# EasyEDA Pro project ProPrj_Hitboard PCB 分体_2025-12-19.epro

# Board PCB1
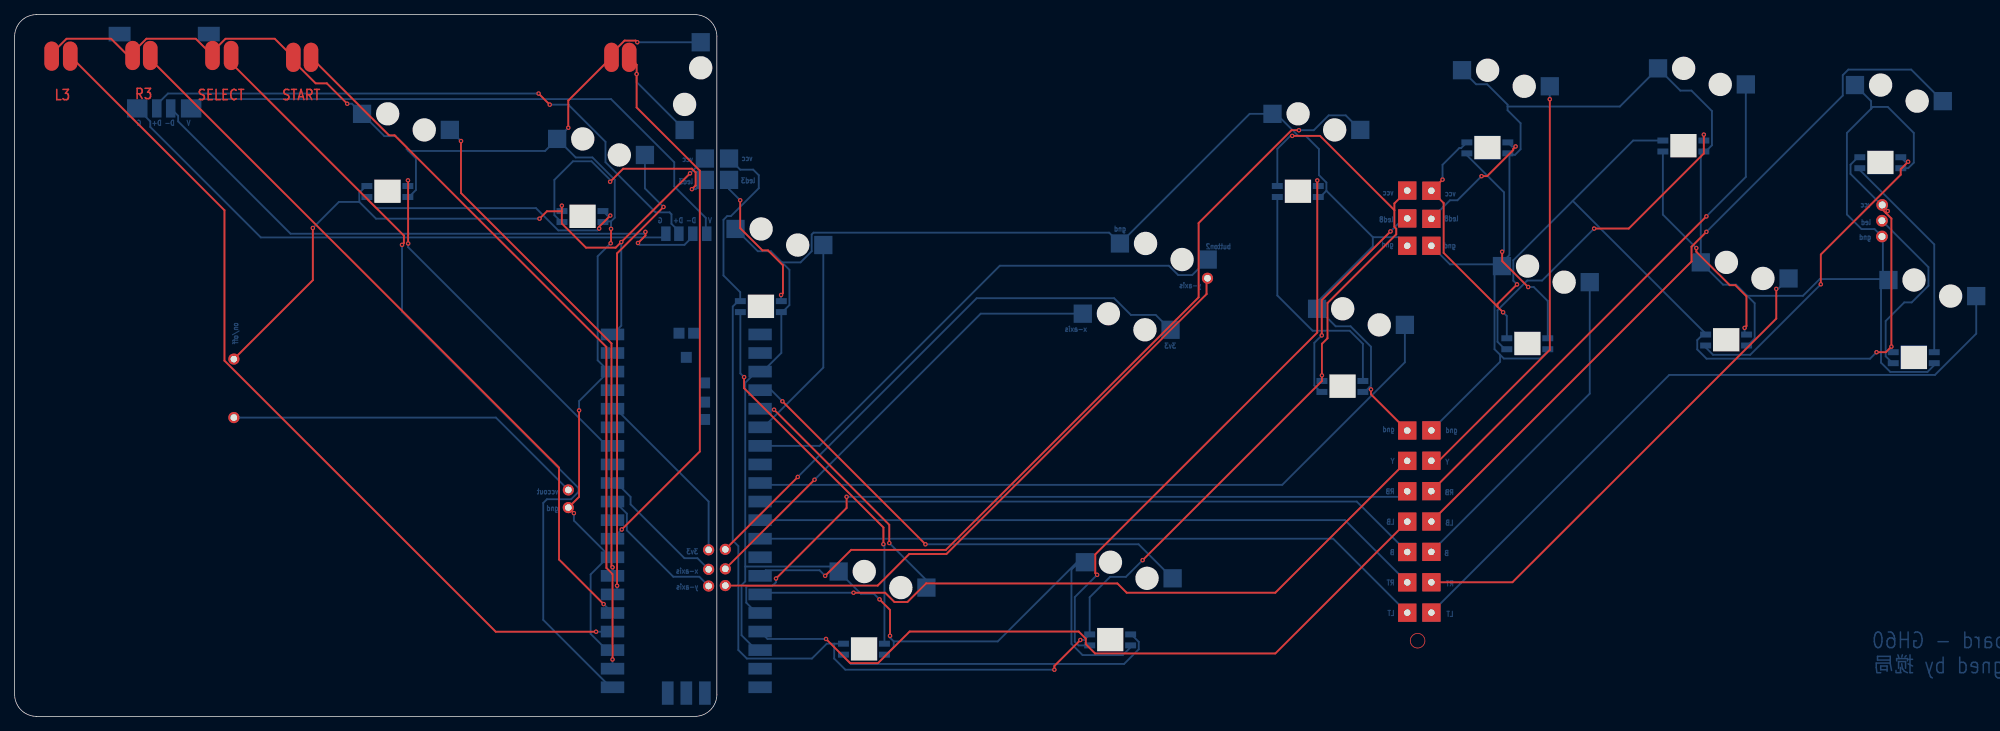
[diagram p0: board, top side]
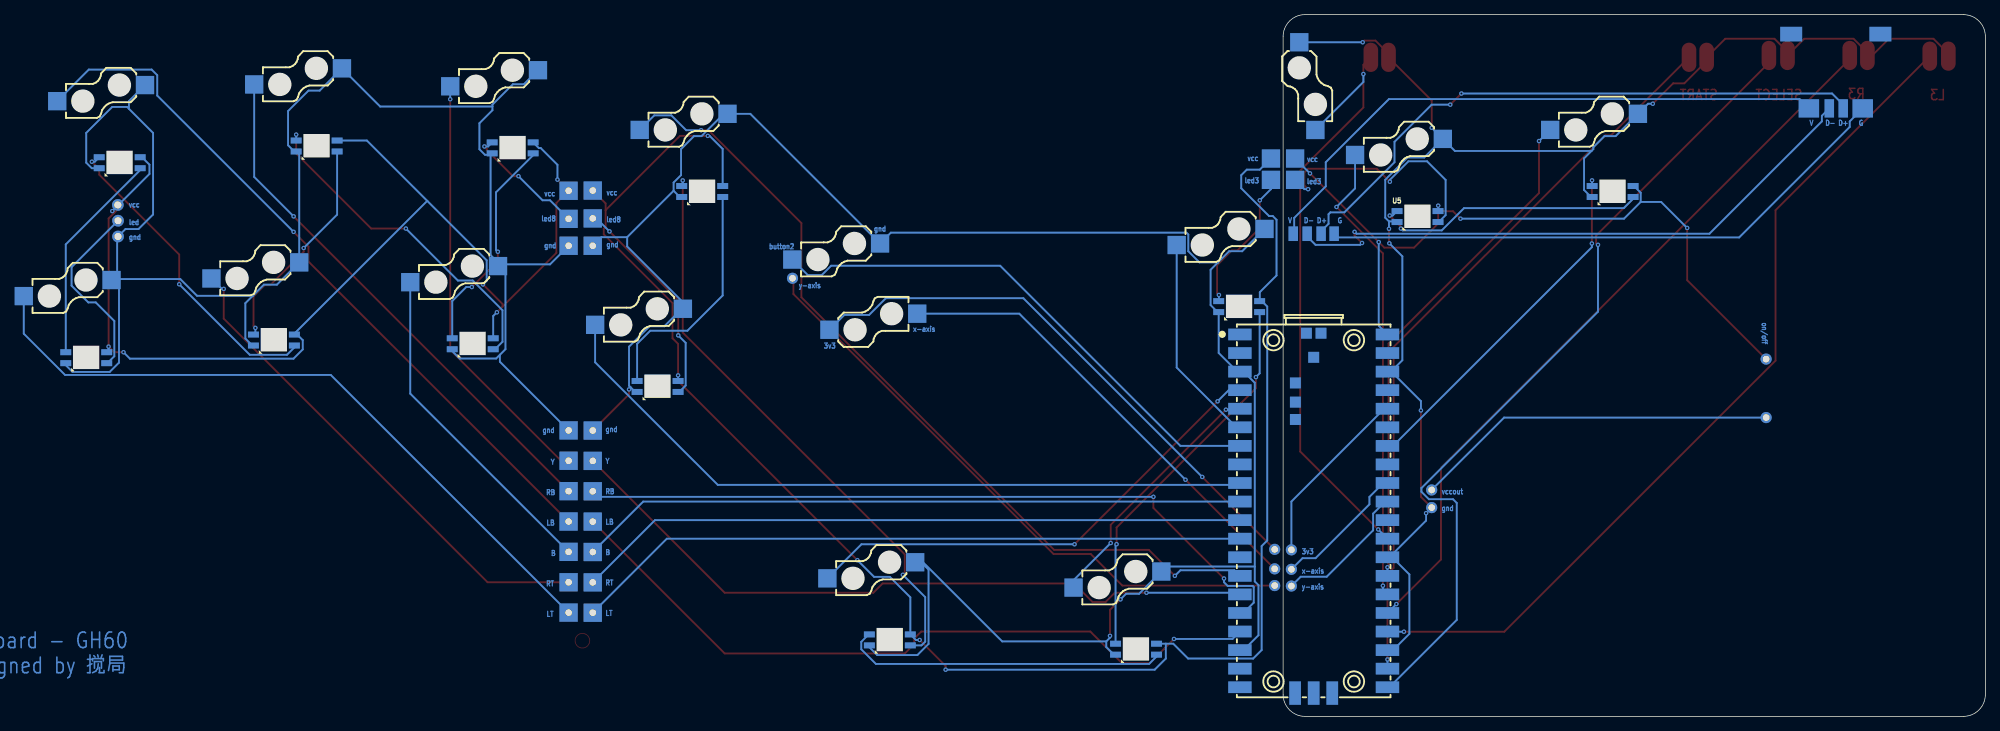
[diagram p1: board, bottom side, seen from below]

Outline 266.25 x 96 mm; copper layers: Top Layer, Bottom Layer. Coordinates in mm from the lower left corner of the outline.
Outline path: 0,93 0,3 arc(0.88,0.88) 3,0 93,0 arc(95.12,0.88) 96,3 96,93 arc(95.12,95.12) 93,96 3,96 arc(0.88,95.12) 0,93
Stack: Top Layer 0.035mm / Dielectric1 1.51mm FR4 er 4.5 / Bottom Layer 0.035mm

## Design rules (mm)
template: JLCPCB Capability(Two Layers Board)
spacing copperThickness1oz (default): track to track 0.102, other pairs 0.152 to 0.3
spacing copperThickness2oz: track to track 0.203, other pairs 0.152 to 0.3
track width copperThickness1oz (default): min 0.127, default 0.254, max 2.54
track width copperThickness2oz: min 0.203, default 0.254, max 2.54
differential pair differentialPair (default): width min 0.127, default 0.254, max 2.54; gap min 0.152, default 0.152
via viaSize (default): diameter min 0.5, default 0.61, max 10; hole min 0.3, default 0.305, max 6.3

## Placement (name value [footprint] x y rotation side)
NOREF  -  [Pad_e62]  75.69 28.56 0 top
NOREF#2  -  [Pad_e693]  92.71 66.03 180 top
NOREF#3  -  [Pad_e684]  19.43 83.17 180 top
NOREF#4  -  [Pad_e6736]  94.36 76.31 0 top
NOREF#5  -  [Pad_e13605]  190.37 26.64 0 top
NOREF#6  -  [Pad_e13636]  193.68 64.38 0 top
NOREF#7  -  [Pad_e48]  94.87 20.12 0 top
NOREF#8  -  [Pad_e13635]  193.68 68.06 0 top
NOREF#9  -  [Pad_e6737]  97.66 73.39 0 top
NOREF#10  -  [Pad_e675]  5.06 90.32 0 top
NOREF#11  -  [Pad_e13602]  190.37 64.38 0 top
NOREF#12  -  [Pad_e69]  193.68 34.97 0 top
NOREF#13  -  [Pad_e689]  89.03 66.03 180 top
NOREF#14  -  [Pad_e679]  27.05 90.41 0 top
NOREF#15  -  [Pad_e687]  97.66 76.31 0 top
NOREF#16  -  [Pad_e683]  16.76 83.17 180 top
NOREF#17  -  [Pad_e61146]  255.3 69.97 0 top
NOREF#18  -  [Pad_e61]  75.69 30.98 0 top
NOREF#19  -  [Pad_e676]  7.6 90.32 0 top
NOREF#20  -  [Pad_e13603]  190.37 34.95 0 top
NOREF#21  -  [Pad_e72]  193.68 22.5 0 top
NOREF#22  -  [Pad_e680]  29.59 90.41 0 top
NOREF#23  -  [Pad_e13606]  190.37 22.49 0 top
NOREF#24  -  [Pad_e13607]  190.37 18.33 0 top
NOREF#25  -  [Pad_e61147]  255.27 67.81 0 top
NOREF#26  -  [Pad_e59]  29.97 48.88 0 top
NOREF#27  -  [Pad_e41]  97.16 22.85 0 top
NOREF#28  -  [Pad_e5941]  163.07 59.93 0 top
NOREF#29  -  [Pad_e114539]  190.37 39.1 0 top
NOREF#30  -  [Pad_e61148]  255.27 65.65 0 top
NOREF#31  -  [Pad_e73]  193.68 18.35 0 top
NOREF#32  -  [Pad_e13601]  190.37 68.12 0 top
NOREF#33  -  [Pad_e13604]  190.37 30.8 0 top
NOREF#34  -  [Pad_e13608]  190.37 14.18 0 top
NOREF#35  -  [Pad_e46]  94.87 22.78 0 top
NOREF#36  -  [Pad_e56]  81.6 90.16 0 top
NOREF#37  -  [Pad_e43]  97.16 20.18 0 top
NOREF#38  -  [Pad_e13600]  190.37 71.93 0 top
NOREF#39  -  [Pad_e686]  24.13 83.17 180 top
NOREF#40  -  [Pad_e677]  16.13 90.41 0 top
NOREF#41  -  [Pad_e53995]  14.35 93.33 180 top
NOREF#42  -  [Pad_e6738]  94.36 73.39 0 top
NOREF#43  -  [Pad_e13637]  193.68 71.9 0 top
NOREF#44  -  [Pad_e53994]  26.54 93.33 180 top
NOREF#45  -  [Pad_e70]  193.68 30.81 0 top
NOREF#46  -  [Pad_e68]  193.68 39.12 0 top
NOREF#47  -  [Pad_e682]  40.51 90.16 0 top
NOREF#48  -  [Pad_e691]  90.81 66.03 180 top
NOREF#49  -  [Pad_e685]  21.34 83.17 180 top
NOREF#50  -  [Pad_e60]  29.97 40.88 0 top
NOREF#51  -  [Pad_e44]  97.16 17.9 0 top
NOREF#52  -  [Pad_e681]  38.1 90.16 0 top
NOREF#53  -  [Pad_e57]  84.01 90.16 0 top
NOREF#54  -  [Pad_e51]  94.87 17.83 0 top
NOREF#55  -  [Pad_e71]  193.68 26.66 0 top
NOREF#56  -  [Pad_e74]  193.68 14.2 0 top
NOREF#57  -  [Pad_e678]  18.54 90.41 0 top
NOREF#58  -  [Pad_e694]  94.61 66.03 180 top
U1  PICO  [COMM-SMD_L51.0-W21.0-P2.54_SC0916]  91.82 27.8 270 bottom
U5  -  [LED-SMD_L3.2-W2.8_YO-WS2812B-3528]  50.95 71.8 180 bottom
U5#2  -  [LED-SMD_L3.2-W2.8_YO-WS2812B-3528]  77.62 68.37 180 bottom
U5#3  -  [LED-SMD_L3.2-W2.8_YO-WS2812B-3528]  102.01 56.05 180 bottom
U5#4  -  [LED-SMD_L3.2-W2.8_YO-WS2812B-3528]  116.11 9.19 180 bottom
U5#5  -  [LED-SMD_L3.2-W2.8_YO-WS2812B-3528]  149.76 10.46 180 bottom
U5#6  -  [LED-SMD_L3.2-W2.8_YO-WS2812B-3528]  175.41 71.8 180 bottom
U5#7  -  [LED-SMD_L3.2-W2.8_YO-WS2812B-3528]  181.51 45.13 180 bottom
U5#8  -  [LED-SMD_L3.2-W2.8_YO-WS2812B-3528]  201.32 77.77 180 bottom
U5#9  -  [LED-SMD_L3.2-W2.8_YO-WS2812B-3528]  206.78 50.97 180 bottom
U5#10  -  [LED-SMD_L3.2-W2.8_YO-WS2812B-3528]  228.12 78.03 180 bottom
U5#11  -  [LED-SMD_L3.2-W2.8_YO-WS2812B-3528]  233.96 51.48 180 bottom
U5#12  -  [LED-SMD_L3.2-W2.8_YO-WS2812B-3528]  255.04 75.74 180 bottom
U5#13  -  [LED-SMD_L3.2-W2.8_YO-WS2812B-3528]  259.62 49.07 180 bottom
U6  -  [CONN-SMD_HOTPLUGPAKAGE__C9900010116-1]  152.02 53.99 0 bottom
U6#2  -  [CONN-SMD_HOTPLUGPAKAGE__C9900010116-1]  157.1 63.59 180 bottom
U6#3  -  [CONN-SMD_HOTPLUGPAKAGE__C9900010116-1]  92.69 86.22 90 bottom
U6#4  -  [CONN-SMD_HOTPLUGPAKAGE__C9900010116-1]  53.49 81.33 180 bottom
U6#5  -  [CONN-SMD_HOTPLUGPAKAGE__C9900010116-1]  80.16 77.9 180 bottom
U6#6  -  [CONN-SMD_HOTPLUGPAKAGE__C9900010116-1]  104.55 65.58 180 bottom
U6#7  -  [CONN-SMD_HOTPLUGPAKAGE__C9900010116-1]  118.65 18.72 180 bottom
U6#8  -  [CONN-SMD_HOTPLUGPAKAGE__C9900010116-1]  152.3 19.99 180 bottom
U6#9  -  [CONN-SMD_HOTPLUGPAKAGE__C9900010116-1]  177.95 81.33 180 bottom
U6#10  -  [CONN-SMD_HOTPLUGPAKAGE__C9900010116-1]  184.05 54.66 180 bottom
U6#11  -  [CONN-SMD_HOTPLUGPAKAGE__C9900010116-1]  203.86 87.3 180 bottom
U6#12  -  [CONN-SMD_HOTPLUGPAKAGE__C9900010116-1]  209.32 60.5 180 bottom
U6#13  -  [CONN-SMD_HOTPLUGPAKAGE__C9900010116-1]  230.66 87.55 180 bottom
U6#14  -  [CONN-SMD_HOTPLUGPAKAGE__C9900010116-1]  236.5 61.01 180 bottom
U6#15  -  [CONN-SMD_HOTPLUGPAKAGE__C9900010116-1]  257.58 85.27 180 bottom
U6#16  -  [CONN-SMD_HOTPLUGPAKAGE__C9900010116-1]  262.16 58.59 180 bottom

## Footprints (pads in the part's own frame, mm; a bottom-side part is the same pattern mirrored in y, then rotated)
COMM-SMD_L51.0-W21.0-P2.54_SC0916
  rect 1.6x3.2 smd: 1(-24.445,-10.088) 2(-21.905,-10.088) 3(-19.365,-10.088) 4(-16.825,-10.088) 5(-14.285,-10.088) 6(-11.745,-10.088) 7(-9.205,-10.088) 8(-6.665,-10.088) 9(-4.125,-10.088) 10(-1.585,-10.088) 11(0.955,-10.088) 12(3.495,-10.088) 13(6.035,-10.088) 14(8.575,-10.088) 15(11.115,-10.088) 16(13.655,-10.088) 17(16.195,-10.088) 18(18.735,-10.088) 19(21.275,-10.088) 20(23.815,-10.088) 21(23.815,10.088) 22(21.275,10.088) 23(18.735,10.088) 24(16.195,10.088) 25(13.655,10.088) 26(11.115,10.088) 27(8.575,10.088) 28(6.035,10.088) 29(3.495,10.088) 30(0.955,10.088) 31(-1.585,10.088) 32(-4.125,10.088) 33(-6.665,10.088) 34(-9.205,10.088) 35(-11.745,10.088) 36(-14.285,10.088) 37(-16.825,10.088) 38(-19.365,10.088) 39(-21.905,10.088) 40(-24.445,10.088)
  rect 3.2x1.6 smd: 41(24.615,-2.54) 42(24.615,0) 43(24.615,2.54)
  rect 1.5x1.5 smd: TP1(-21.315,0) TP2(-24.615,1) TP3(-24.615,-1) TP4(-17.815,-2.5) TP5(-15.188,-2.5) TP6(-12.815,-2.5)
CONN-SMD_HOTPLUGPAKAGE__C9900010116-1
  rect 2.5x2.5 smd: 1(-6,-1.1) 2(6,1.1)
LED-SMD_L3.2-W2.8_YO-WS2812B-3528
  rect 1.5x0.82 smd: 1(2.8,0.75) 2(2.8,-0.75) 3(-2.8,-0.75) 4(-2.8,0.75)
Pad_e41
  round 1.524 hole 0.914: 1(0,0)
Pad_e43
  round 1.524 hole 0.914: 1(0,0)
Pad_e44
  round 1.524 hole 0.914: 1(0,0)
Pad_e46
  round 1.524 hole 0.914: 1(0,0)
Pad_e48
  round 1.524 hole 0.914: 1(0,0)
Pad_e51
  round 1.524 hole 0.914: 1(0,0)
Pad_e56
  oval 2x4 smd: 1(0,0)
Pad_e57
  oval 2x4 smd: 1(0,0)
Pad_e59
  round 1.524 hole 0.914: 1(0,0)
Pad_e60
  round 1.524 hole 0.914: 1(0,0)
Pad_e61
  round 1.524 hole 0.914: 1(0,0)
Pad_e62
  round 1.524 hole 0.914: 1(0,0)
Pad_e68
  rect 2.5x2.5 hole 0.9: PTH(0,0)
Pad_e69
  rect 2.5x2.5 hole 0.9: PTH(0,0)
Pad_e70
  rect 2.5x2.5 hole 0.9: PTH(0,0)
Pad_e71
  rect 2.5x2.5 hole 0.9: PTH(0,0)
Pad_e72
  rect 2.5x2.5 hole 0.9: PTH(0,0)
Pad_e73
  rect 2.5x2.5 hole 0.9: PTH(0,0)
Pad_e74
  rect 2.5x2.5 hole 0.9: PTH(0,0)
Pad_e675
  oval 2x4 smd: 1(0,0)
Pad_e676
  oval 2x4 smd: 1(0,0)
Pad_e677
  oval 2x4 smd: 1(0,0)
Pad_e678
  oval 2x4 smd: 1(0,0)
Pad_e679
  oval 2x4 smd: 1(0,0)
Pad_e680
  oval 2x4 smd: 1(0,0)
Pad_e681
  oval 2x4 smd: 1(0,0)
Pad_e682
  oval 2x4 smd: 1(0,0)
Pad_e683
  rect 2.8x2.5 smd far side: PTH(0,0)
Pad_e684
  rect 1.3x2.5 smd far side: PTH(0,0)
Pad_e685
  rect 1.3x2.5 smd far side: PTH(0,0)
Pad_e686
  rect 2.8x2.5 smd far side: PTH(0,0)
Pad_e687
  rect 2.5x2.5 smd far side: PTH(0,0)
Pad_e689
  rect 1.3x2 smd far side: PTH(0,0)
Pad_e691
  rect 1.3x2 smd far side: PTH(0,0)
Pad_e693
  rect 1.3x2 smd far side: PTH(0,0)
Pad_e694
  rect 1.3x2 smd far side: PTH(0,0)
Pad_e5941
  round 1.524 hole 0.914: 1(0,0)
Pad_e6736
  rect 2.5x2.5 smd far side: PTH(0,0)
Pad_e6737
  rect 2.5x2.5 smd far side: PTH(0,0)
Pad_e6738
  rect 2.5x2.5 smd far side: PTH(0,0)
Pad_e13600
  rect 2.5x2.5 hole 0.9: PTH(0,0)
Pad_e13601
  rect 2.5x2.5 hole 0.9: PTH(0,0)
Pad_e13602
  rect 2.5x2.5 hole 0.9: PTH(0,0)
Pad_e13603
  rect 2.5x2.5 hole 0.9: PTH(0,0)
Pad_e13604
  rect 2.5x2.5 hole 0.9: PTH(0,0)
Pad_e13605
  rect 2.5x2.5 hole 0.9: PTH(0,0)
Pad_e13606
  rect 2.5x2.5 hole 0.9: PTH(0,0)
Pad_e13607
  rect 2.5x2.5 hole 0.9: PTH(0,0)
Pad_e13608
  rect 2.5x2.5 hole 0.9: PTH(0,0)
Pad_e13635
  rect 2.5x2.5 hole 0.9: PTH(0,0)
Pad_e13636
  rect 2.5x2.5 hole 0.9: PTH(0,0)
Pad_e13637
  rect 2.5x2.5 hole 0.9: PTH(0,0)
Pad_e53994
  rect 3x2 smd far side: PTH(0,0)
Pad_e53995
  rect 3x2 smd far side: PTH(0,0)
Pad_e61146
  round 1.6 hole 0.96: PTH(0,0)
Pad_e61147
  round 1.6 hole 0.96: PTH(0,0)
Pad_e61148
  round 1.6 hole 0.96: PTH(0,0)
Pad_e114539
  rect 2.5x2.5 hole 0.9: PTH(0,0)

## Nets
3V3: NOREF#27.1 NOREF#35.1 U1.36 U6.2
GND: NOREF.1 NOREF#6.PTH NOREF#10.1 NOREF#11.PTH NOREF#14.1 NOREF#29.PTH NOREF#30.PTH NOREF#36.1 NOREF#40.1 NOREF#46.PTH NOREF#52.1 U1.3 U1.18 U1.23 U1.28 U1.38 U5.3 U5#2.3 U5#3.3 U5#4.3 U5#5.3 U5#6.3 U5#7.3 U5#8.3 U5#9.3 U5#10.3 U5#11.3 U5#12.3 U5#13.3 U6#2.2 U6#3.2 U6#4.2 U6#5.2 U6#6.2 U6#7.2 U6#8.2 U6#9.2 U6#10.2 U6#11.2 U6#12.2 U6#13.2 U6#14.2 U6#15.2 U6#16.2
VCC: NOREF#4.PTH NOREF#15.PTH NOREF#17.PTH NOREF#26.1 NOREF#38.PTH NOREF#43.PTH U1.40 U5.1 U5#2.1 U5#3.1 U5#4.1 U5#5.1 U5#6.1 U5#7.1 U5#8.1 U5#9.1 U5#10.1 U5#11.1 U5#12.1 U5#13.1
VCCOUT: NOREF#18.1 NOREF#50.1
2: U5.2 U5#2.4
3: NOREF#9.PTH NOREF#42.PTH U5#2.2 U5#3.4
4: U5#3.2 U5#4.4
5: U5#4.2 U5#5.4
6: U5#5.2 U5#6.4
7: U5#6.2 U5#7.4
8: NOREF#8.PTH NOREF#32.PTH U5#7.2 U5#8.4
9: U5#8.2 U5#9.4
10: U5#9.2 U5#10.4
11: U5#10.2 U5#11.4
12: U5#11.2 U5#12.4
13: U5#12.2 U5#13.4
14: NOREF#25.PTH U5#13.2
A: U1.9 U6#10.1
B: NOREF#21.PTH NOREF#23.PTH U1.10 U6#12.1
BUTTON1: U1.5 U6#7.1
BUTTON2: U1.7 U6#2.1
CAPTURE: NOREF#53.1 U1.29 U6#3.1
D+: NOREF#3.PTH NOREF#48.PTH
D-: NOREF#2.PTH NOREF#49.PTH
DOWN: U1.26 U6#5.1
G: NOREF#13.PTH NOREF#16.PTH
L3: NOREF#19.1 U1.24
LB: NOREF#5.PTH NOREF#55.PTH U1.17 U6#15.1
LED1: U1.34 U5.4
LEFT: U1.27 U6#4.1
LT: NOREF#34.PTH NOREF#56.PTH U1.12 U6#16.1
R3: NOREF#57.1 U1.25
RB: NOREF#33.PTH NOREF#45.PTH U1.16 U6#13.1
RIGHT: U1.6 U6#6.1
RT: NOREF#24.PTH NOREF#31.PTH U1.11 U6#14.1
SELECT: NOREF#22.1 U1.21
START: NOREF#47.1 U1.22
UP: U1.4 U6#8.1
V: NOREF#39.PTH NOREF#58.PTH
X: U1.14 U6#9.1
X-AXIS: NOREF#7.1 NOREF#37.1 U1.32 U6.1
Y: NOREF#12.PTH NOREF#20.PTH U1.15 U6#11.1
Y-AXIS: NOREF#28.1 NOREF#51.1 NOREF#54.1 U1.31

Pads without a net: NOREF#41 PTH; NOREF#44 PTH; U1 1 2 8 13 19 20 30 33 35 37 39 41 42 43 TP1 TP2 TP3 TP4 TP5 TP6

## Via types
v1: diameter 0.61, hole 0.305, Top Layer to Bottom Layer, 80 vias

## Routing (per net, layer and track width the routed paths; a pad name or vN(x,y) marks a point on that pad's centre or on a via; arc(x,y) is an arc through that point)
3V3: length 101.9
  Top Layer w0.254: NOREF#27.1 v1(107.06,32.75)
  Bottom Layer w0.254: v1(107.06,32.75) 131.51,57.2 150.31,57.2 152.59,54.92 155.99,54.92 158.02,52.89 ; NOREF#35.1 94.87,29.39 82.17,42.09 U1.36
GND: length 729.5
  Top Layer w0.254: 15.98,90.41 NOREF#40.1 ; 15.98,90.41 15.48,90.41 13.19,92.7 7.09,92.7 5.06,90.67 NOREF#10.1 ; 15.98,90.41 15.98,90.67 18.02,92.7 24.77,92.7 NOREF#14.1 27.05,90.92 28.83,92.7 35.56,92.7 NOREF#52.1 38.1,89.65 41.15,86.6 42.67,86.6 v1(45.47,83.81) ; v1(118.23,16.01) 119.67,14.57 v1(119.67,11.02) ; NOREF#29.PTH 185.42,44.06 v1(185.42,44.73) ; v1(76.45,27.8) NOREF.1 77.16,30.03 v1(77.16,41.86) ; v1(75.69,80.52) 75.69,84.25 NOREF#36.1 81.6,90.67 83.38,92.44 84.9,92.44 v1(85.12,92.22) ; v1(81.53,66.7) 81.53,64.77 v1(81.48,64.72)
  Bottom Layer w0.254: 204.09,83.43 219.44,83.43 U6#13.2 227.71,85.6 229.23,85.6 232.03,82.81 232.03,78.13 231.17,77.28 U5#10.3 230.5,76.86 U6#14.2 233.55,59.06 235.33,59.06 236.85,57.54 ; 204.09,83.43 204.09,82.92 205.87,81.14 205.87,77.58 205.1,76.82 204.34,76.82 ; 204.09,83.43 204.09,83.68 201.29,86.47 199.78,86.47 U6#11.2 ; U6#16.2 256.03,59.82 255.9,59.82 ; U5#5.3 152.56,9.46 151.49,8.39 145.99,8.39 144.47,9.91 144.47,20.07 145.49,21.09 ; 204.34,76.82 204.34,63.11 203.07,61.84 ; 204.34,76.82 U5#8.3 ; 81.23,47.19 77.16,43.13 v1(77.16,41.86) ; 81.23,47.19 81.71,47.19 U1.38 ; 81.23,47.19 79.7,48.72 79.7,62.94 v1(81.48,64.72) ; 203.07,61.84 196.22,61.84 NOREF#6.PTH ; 203.07,61.84 U6#12.2 202.31,60.58 202.31,50.22 203.07,49.46 ; 253.78,83.12 254.03,83.37 256.07,83.37 259.62,79.82 259.62,75.75 258.86,74.99 U5#12.3 ; 253.78,83.12 250.48,79.82 250.48,68.66 252.48,66.66 254.25,66.66 NOREF#30.PTH 255.39,65.52 255.39,59.82 ; 253.78,83.12 253.78,84.17 U6#15.2 ; 120.18,10.25 120.18,9.49 119.28,8.59 119.06,8.59 U5#4.3 ; 120.18,10.25 134.4,10.25 145.23,21.09 145.49,21.09 ; 120.18,10.25 119.67,10.76 v1(119.67,11.02) ; 99.88,20.5 99.88,45.64 101.4,47.17 U1.3 101.92,47.18 102.27,47.18 104.81,49.72 U5#3.3 104.95,55.3 105.91,56.27 105.91,61.09 104.9,62.11 ; 99.88,20.5 111.97,20.5 U6#7.2 115.69,16.77 117.47,16.77 v1(118.23,16.01) ; 99.88,20.5 99.88,18.46 99.37,17.96 99.37,11.1 101.4,9.07 U1.18 ; U5#6.3 178.47,71.05 179.32,71.91 ; U1.28 81.54,21.96 81.28,21.96 ; 104.9,62.11 107.44,62.11 108.96,63.63 108.96,65.92 109.22,66.17 149.62,66.17 U6#2.2 168.83,82.43 U6#9.2 172.46,82.43 175.51,79.38 176.53,79.38 178.3,77.6 178.3,74.05 179.32,73.03 179.32,71.91 ; 104.9,62.11 103.37,63.63 101.6,63.63 U6#6.2 ; NOREF#46.PTH 203.07,48.51 203.07,49.46 ; 236.85,57.54 244.47,57.54 246.76,59.82 255.39,59.82 ; 236.85,57.54 237.87,56.52 237.87,51.69 236.91,50.73 U5#11.3 ; 255.39,59.82 255.9,59.82 ; 203.07,49.46 203.58,48.95 208.57,48.95 209.58,49.97 U5#9.3 ; 53.84,77.35 72.51,77.35 U6#5.2 ; 53.84,77.35 53.59,77.6 53.59,77.86 52.07,79.38 50.54,79.38 U6#4.2 46.11,83.81 v1(45.47,83.81) ; 53.84,77.35 54.86,76.33 54.86,72.01 53.9,71.05 U5.3 ; v1(76.45,27.8) 76.45,26.78 81.28,21.96 ; U1.23 80.97,9.07 78.74,11.29 78.74,19.42 81.28,21.96 ; 179.32,71.91 185.67,65.55 ; NOREF#11.PTH 189.19,65.55 185.67,65.55 ; U6#5.2 76.7,76.46 78.99,76.46 82.04,73.41 82.04,68.22 81.53,67.71 ; U6#5.2 v1(75.69,80.52) ; 178.05,55.9 180.59,53.36 182.62,53.36 185.42,50.57 185.42,45.23 185.16,44.98 ; 178.05,55.9 178.05,56.67 185.67,64.28 185.67,65.55 ; 178.05,55.9 U6#10.2 ; 185.16,44.98 v1(185.42,44.73) ; 185.16,44.98 184.56,44.38 U5#7.3 ; 81.53,67.71 80.51,67.71 U5#2.3 ; 81.53,67.71 v1(81.53,66.7) ; v1(85.12,92.22) U6#3.2 ; 255.9,59.82 255.14,59.06 255.14,48.39 256.41,47.12 261.49,47.12 262.42,48.05 U5#13.3 ; 145.49,21.09 U6#8.2
VCC: length 496.6
  Top Layer w0.254: 202.71,56.04 195.35,63.41 195.35,70.23 NOREF#43.PTH v1(195.2,73.43) ; 202.71,56.04 202.71,56.42 v1(205.38,59.09) ; 202.71,56.04 v1(203.48,55.28) ; v1(174.65,79.41) 178.46,79.41 188.62,69.25 ; v1(71.75,68.09) 72.77,69.1 74.8,69.1 ; 188.62,69.25 188.62,70.18 NOREF#38.PTH ; 188.62,69.25 188.62,66.97 188.87,66.71 188.87,65.95 179.47,56.55 179.47,51.72 178.71,50.96 v1(178.71,46.64) U5#7.1 v1(154.2,21.37) ; 74.8,69.1 v1(74.8,69.86) ; 74.8,69.1 74.8,67.42 78.11,64.12 82.17,64.12 v1(82.93,64.89) v1(92.33,74.28) ; 255.8,68.87 255.3,69.37 NOREF#17.PTH ; 255.8,68.87 256.56,68.11 v1(256.56,50.58) 255.8,49.82 v1(254.53,49.82) ; 255.8,68.87 v1(256.05,69.12) ; v1(142.13,6.39) 142.13,6.89 v1(145.69,10.45) ; NOREF#26.1 40.77,59.67 v1(40.77,66.82)
  Bottom Layer w0.254: U1.40 82.93,53.44 v1(82.93,64.89) ; U5#8.1 197.74,77.74 197.49,77.74 195.2,75.46 v1(195.2,73.43) ; v1(40.77,66.82) 44.32,70.37 47.12,70.37 ; U5#12.1 251.99,76.49 250.97,75.47 250.97,74.2 v1(256.05,69.12) ; 47.12,70.37 47.12,71.64 48.03,72.55 U5.1 ; 47.12,70.37 49.4,68.09 v1(71.75,68.09) ; 112.04,9.94 112.04,7.91 113.56,6.39 v1(142.13,6.39) ; 112.04,9.94 U5#4.1 ; 112.04,9.94 111.02,9.94 108.99,7.91 100.1,7.91 98.93,9.07 98.93,23.3 98.17,24.06 98.17,56.06 98.93,56.83 99.19,56.83 ; U5#10.1 221.26,78.78 213,70.52 ; 99.19,56.83 99.19,58.03 96.9,60.31 96.9,67.93 97.41,68.44 97.92,68.44 101.73,72.25 101.73,74.03 100.97,74.79 99.19,74.79 NOREF#15.PTH ; 99.19,56.83 U5#3.1 ; U5#13.1 256.56,50.07 v1(256.56,50.58) ; v1(145.69,10.45) 146.2,10.45 U5#5.1 146.96,16.29 149.75,19.09 151.91,19.09 v1(154.2,21.37) ; 213,70.52 231.03,52.49 ; 213,70.52 204.87,62.39 204.87,59.6 v1(205.38,59.09) ; 231.03,52.49 230.02,51.47 230.02,50.2 231.29,48.93 253.64,48.93 v1(254.53,49.82) ; 231.03,52.49 231.03,52.36 U5#11.1 ; v1(178.71,46.64) U5#7.1 ; v1(174.65,79.41) 174.39,79.41 172.61,77.63 U5#6.1 ; U5#9.1 203.98,54.77 v1(203.48,55.28) ; NOREF#4.PTH v1(92.33,74.28) ; v1(74.8,69.86) 74.8,69.15 U5#2.1
VCCOUT: length 49.8
  Bottom Layer w0.254: NOREF#18.1 65.79,40.88 NOREF#50.1
2: length 37.6
  Top Layer w0.254: v1(81.43,68.51) 79.9,66.99 v1(79.9,66.73)
  Bottom Layer w0.254: v1(81.43,68.51) 81.04,68.51 U5#2.4 ; v1(79.9,66.73) 79.65,66.48 74.32,66.48 71.27,69.53 49.42,69.53 48.15,70.8 U5.2
3: length 53.9
  Top Layer w0.254: v1(99.19,70.6) 99.19,66.79 102.23,63.74 103,63.74 105.03,61.71 105.03,57.9 v1(104.78,57.65) ; v1(81.41,73.14) 83.19,74.92 92.58,74.92 93.09,74.41 93.09,72.63 v1(92.58,72.12)
  Bottom Layer w0.254: NOREF#9.PTH 97.66,72.12 v1(99.19,70.6) ; v1(92.58,72.12) 93.09,72.12 NOREF#42.PTH ; U5#3.4 104.78,56.84 v1(104.78,57.65) ; U5#2.2 74.73,67.62 73.79,68.57 73.79,73.39 76.33,75.93 78.87,75.93 81.41,73.39 v1(81.41,73.14)
4: length 53.5
  Top Layer w0.254: v1(118.77,23.55) 118.77,25.84 99.72,44.89 v1(99.72,46.42)
  Bottom Layer w0.254: U5#3.2 99.21,46.92 v1(99.72,46.42) ; v1(118.77,23.55) 118.91,23.42 U5#4.4
5: length 44.4
  Bottom Layer w0.254: U5#5.4 152.65,11.21 153.67,10.2 153.67,9.18 151.66,7.17 114.32,7.17 113.31,8.19 U5#4.2
6: length 80.1
  Top Layer w0.254: v1(147.98,19.36) 147.72,19.62 147.72,22.16 178.08,52.51 v1(178.08,73.31)
  Bottom Layer w0.254: U5#6.4 178.08,72.69 v1(178.08,73.31) ; v1(147.98,19.36) 144.93,16.32 144.93,10.22 145.44,9.71 U5#5.2
7: length 33
  Bottom Layer w0.254: U5#7.4 184.31,50.96 182.52,52.75 177.44,52.75 172.61,57.58 U5#6.2
8: length 46.8
  Top Layer w0.254: v1(178.69,52.12) 178.69,56.95 v1(188.09,66.35) ; v1(200.53,73.9) 201.29,73.9 204.87,77.48 204.87,77.65 v1(205.19,77.97)
  Bottom Layer w0.254: v1(178.69,52.12) 177.67,51.11 177.67,45.26 178.55,44.38 U5#7.2 ; v1(188.09,66.35) 189.87,68.12 NOREF#32.PTH ; U5#8.4 204.68,77.97 v1(205.19,77.97) ; NOREF#8.PTH 196.22,70.6 197.23,70.6 v1(200.53,73.9)
9: length 30.5
  Top Layer w0.254: v1(203.35,63.56) 203.35,62.29 v1(206.9,58.73)
  Bottom Layer w0.254: U5#9.4 209.58,56.82 207.67,58.73 v1(206.9,58.73) ; U5#8.2 198.52,76.77 203.6,71.69 203.6,63.81 v1(203.35,63.56)
10: length 46.5
  Top Layer w0.254: v1(230.92,79.59) 230.92,77 220.66,66.73 v1(215.92,66.73)
  Bottom Layer w0.254: v1(230.92,79.59) U5#10.4 ; U5#9.2 203.73,50.22 202.71,51.24 202.71,55.56 206.78,59.62 208.81,59.62 v1(215.92,66.73)
11: length 30.4
  Top Layer w0.254: v1(229.89,64.07) 229.89,63.56 234.46,58.99 235.23,58.99 236.75,57.46 236.75,53.4 v1(236.5,53.15)
  Bottom Layer w0.254: v1(229.89,64.07) 225.32,68.64 U5#10.2 ; v1(236.5,53.15) 236.5,52.5 U5#11.4
12: length 43.4
  Top Layer w0.254: v1(258.85,75.88) 257.83,74.86 257.83,74.1 246.91,63.18 v1(246.91,59.11)
  Bottom Layer w0.254: U5#12.4 258.45,75.88 v1(258.85,75.88) ; U5#11.2 231.16,50.48 232.18,49.46 237.26,49.46 v1(246.91,59.11)
13: length 29.4
  Bottom Layer w0.254: U5#12.2 252.24,74.74 262.42,64.56 U5#13.4
14: length 25.6
  Bottom Layer w0.254: NOREF#25.PTH 261.62,61.46 261.62,58.92 259.33,56.63 258.32,56.63 255.78,54.09 255.78,49.26 256.72,48.32 U5#13.2
A: length 100.3
  Bottom Layer w0.254: U6#10.1 190.05,48.44 173.28,31.67 102.16,31.67 U1.9
B: length 137.2
  Bottom Layer w0.254: U1.10 183.47,29.39 NOREF#23.PTH ; NOREF#21.PTH 215.32,44.15 U6#12.1
BUTTON1: length 34.9
  Top Layer w0.254: v1(103.82,41.95) 119.57,26.21 v1(119.57,23.71)
  Bottom Layer w0.254: U1.5 102.04,41.95 v1(103.82,41.95) ; v1(119.57,23.71) 124.65,18.63 124.65,17.62
BUTTON2: length 72.8
  Bottom Layer w0.254: U6#2.1 160.98,60.37 159.06,60.37 157.79,61.64 134.67,61.64 110.04,37.01 U1.7
CAPTURE: length 85.2
  Top Layer w0.254: v1(82.99,25.57) 93.66,36.23 93.66,74.66 85.03,83.3 v1(85.03,87.87) 85.03,89.14 NOREF#53.1
  Bottom Layer w0.254: v1(85.03,87.87) 85.03,86.78 U6#3.1 ; v1(82.99,25.57) U1.29
D+: length 83.1
  Top Layer w0.254: v1(71.63,85.2) v1(73.15,83.68)
  Bottom Layer w0.254: NOREF#48.PTH 90.69,66.15 90.69,66.49 89.79,67.38 89.79,68.69 89.53,68.95 87.63,68.95 80.77,75.81 80.77,78.6 75.69,83.68 v1(73.15,83.68) ; NOREF#3.PTH 19.43,83.68 20.95,85.2 v1(71.63,85.2)
D-: length 82.9
  Top Layer w0.254: v1(85.22,64.76) 86.23,65.77 v1(86.23,66.28)
  Bottom Layer w0.254: NOREF#49.PTH 22.35,82.16 22.35,81.39 37.72,66.03 85.98,66.03 v1(86.23,66.28) ; v1(85.22,64.76) 85.47,64.5 91.57,64.5 92.71,65.65 NOREF#2.PTH
DOWN: length 64.1
  Top Layer w0.254: v1(82.35,17.87) 82.35,63.34 v1(88.7,69.69)
  Bottom Layer w0.254: U6#5.1 86.16,72.23 v1(88.7,69.69) ; v1(82.35,17.87) 82.35,17.31 U1.26
G: length 80.2
  Bottom Layer w0.254: NOREF#16.PTH 18.54,81.39 18.54,80.63 33.66,65.52 88.52,65.52 NOREF#13.PTH
L3: length 118.8
  Top Layer w0.254: NOREF#19.1 28.68,69.24 28.68,48.66 65.77,11.58 v1(79.48,11.58)
  Bottom Layer w0.254: U1.24 81.71,11.58 v1(79.48,11.58)
LB: length 201.3
  Top Layer w0.254: v1(231.27,66.28) 229.24,64.25 229.24,62.22 NOREF#55.PTH ; v1(110.92,10.59) 114.22,7.29 118.03,7.29 122.35,11.61 145.47,11.61 146.43,10.64 146.43,9.88 147.7,8.61 172.34,8.61 NOREF#5.PTH
  Bottom Layer w0.254: v1(231.27,66.28) 249.91,84.93 249.91,87.72 250.67,88.48 259.27,88.48 U6#15.1 ; U1.17 102.92,10.59 v1(110.92,10.59)
LED1: length 49.1
  Top Layer w0.254: v1(53.77,73.33) 53.79,73.3 v1(53.79,64.69)
  Bottom Layer w0.254: U1.34 80.97,37.01 53.79,64.18 v1(53.79,64.69) ; U5.4 53.77,72.57 v1(53.77,73.33)
LEFT: length 70.2
  Top Layer w0.254: v1(81.73,20.4) 81.59,20.54 81.59,51.02 61.02,71.59 v1(61.02,78.7)
  Bottom Layer w0.254: v1(81.73,20.4) U1.27 ; U6#4.1 v1(61.02,78.7)
LT: length 188.1
  Bottom Layer w0.254: NOREF#56.PTH 226.19,46.71 262.51,46.71 268.16,52.35 U6#16.1 ; U1.12 180.25,24.31 NOREF#34.PTH
R3: length 102.4
  Top Layer w0.254: v1(80.52,15.36) 74.42,21.46 74.42,34.02 18.54,89.9 NOREF#57.1
  Bottom Layer w0.254: v1(80.52,15.36) U1.25
RB: length 175
  Top Layer w0.254: NOREF#45.PTH v1(231.27,68.4) ; v1(113.73,30.03) 113.73,28.51 v1(104.08,18.86)
  Bottom Layer w0.254: U6#13.1 236.66,73.8 v1(231.27,68.4) ; U1.16 101.77,14.29 101.29,14.29 100.02,15.56 100.02,17.7 100.16,17.84 103.57,17.84 104.08,18.35 v1(104.08,18.86) ; v1(113.73,30.03) 189.61,30.03 NOREF#33.PTH
RIGHT: length 28.8
  Bottom Layer w0.254: U1.6 101.95,39.59 102.42,39.59 110.55,47.72 U6#6.1
RT: length 160.4
  Top Layer w0.254: NOREF#31.PTH 204.75,18.35 240.82,54.42 v1(240.82,58.48)
  Bottom Layer w0.254: U6#14.1 241.08,58.48 v1(240.82,58.48) ; NOREF#24.PTH 181.86,26.85 U1.11
SELECT: length 114.3
  Top Layer w0.254: NOREF#22.1 29.59,89.4 53.21,65.77 53.21,64.76 v1(52.96,64.5)
  Bottom Layer w0.254: U1.21 81.67,4.05 81.41,4.05 72.26,13.2 72.26,29.2 72.77,29.71 76.07,29.71 77.09,30.72 77.09,31.23 52.96,55.36 v1(52.96,64.5)
START: length 101.2
  Top Layer w0.254: v1(81.73,7.79) 81.73,19.47 80.9,20.31 80.9,50.53 51.94,79.49 51.18,79.49 NOREF#47.1
  Bottom Layer w0.254: v1(81.73,7.79) U1.22
UP: length 67.1
  Top Layer w0.254: v1(104.96,43.1) v1(124.51,23.54)
  Bottom Layer w0.254: U6#8.1 153.64,23.54 v1(124.51,23.54) ; v1(104.96,43.1) 103.43,44.63 U1.4
V: length 81.8
  Bottom Layer w0.254: NOREF#39.PTH 25.4,84.44 81.53,84.44 90.17,75.81 90.17,72.5 94.49,68.19 94.49,66.16 NOREF#58.PTH
X: length 115.5
  Top Layer w0.254: v1(175.57,80.19) 174.55,80.19 161.85,67.49 161.85,57.33 127.31,22.78 114.35,22.78 v1(110.8,19.23)
  Bottom Layer w0.254: U1.14 102.67,19.99 110.04,19.99 v1(110.8,19.23) ; U6#9.1 181.96,82.22 179.63,82.22 177.6,80.19 v1(175.57,80.19)
X-AXIS: length 81.9
  Top Layer w0.254: NOREF#37.1 v1(109.35,32.37)
  Bottom Layer w0.254: U1.32 82.3,31.93 84.2,30.02 84.2,29.01 91.57,21.64 93.34,21.64 NOREF#7.1 ; v1(109.35,32.37) 132.06,55.09 146.02,55.09
Y: length 156.7
  Top Layer w0.254: v1(114.68,16.92) 119,16.92 120.27,15.65 122.05,15.65 124.59,18.19 150.75,18.19 152.02,16.92 172.34,16.92 NOREF#20.PTH ; v1(209.86,84.43) 209.86,50.14 194.69,34.97 NOREF#12.PTH
  Bottom Layer w0.254: v1(209.86,84.43) U6#11.1 ; v1(114.68,16.92) 102.14,16.92 U1.15
Y-AXIS: length 103.8
  Top Layer w0.254: NOREF#51.1 117.98,17.9 122.3,22.21 127.38,22.21 162.94,57.77 162.94,59.8 NOREF#28.1
  Bottom Layer w0.254: NOREF#54.1 93.6,19.1 90.04,19.1 83.69,25.45 83.69,27.74 82.04,29.39 U1.31

## Text on the board
Bottom Layer: G | D+ | D- | V | vcc | led3 | 3v3 | x-axis | y-axis | gnd | button2 | led8 | Y | RB | LB | B | RT | LT | led | on/off | vccout | Hitboard - GH60 / Designed by 搅局
Top Layer: L3 | R3 | SELECT | START
